# EAGLE design Light_Tester (EAGLE 6.3)
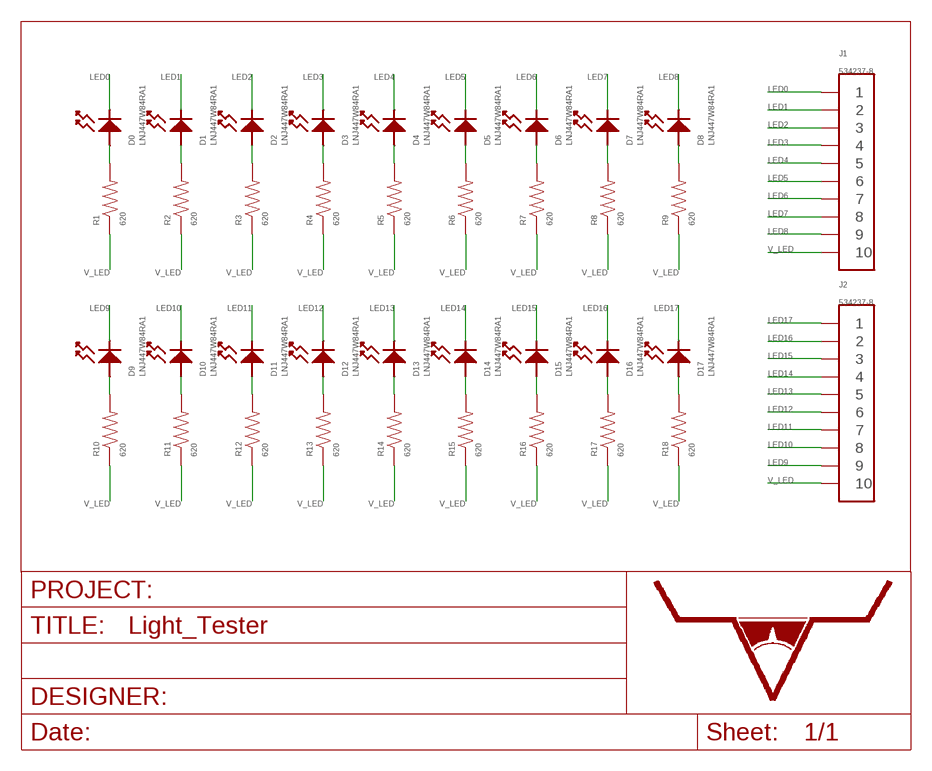
[diagram p0: schematic, sheet 1]

## Parts
D0  LNJ447W84RA1  LED_SINGLE0402  [LED_0402]
D1  LNJ447W84RA1  LED_SINGLE0402  [LED_0402]
D2  LNJ447W84RA1  LED_SINGLE0402  [LED_0402]
D3  LNJ447W84RA1  LED_SINGLE0402  [LED_0402]
D4  LNJ447W84RA1  LED_SINGLE0402  [LED_0402]
D5  LNJ447W84RA1  LED_SINGLE0402  [LED_0402]
D6  LNJ447W84RA1  LED_SINGLE0402  [LED_0402]
D7  LNJ447W84RA1  LED_SINGLE0402  [LED_0402]
D8  LNJ447W84RA1  LED_SINGLE0402  [LED_0402]
D9  LNJ447W84RA1  LED_SINGLE0402  [LED_0402]
D10  LNJ447W84RA1  LED_SINGLE0402  [LED_0402]
D11  LNJ447W84RA1  LED_SINGLE0402  [LED_0402]
D12  LNJ447W84RA1  LED_SINGLE0402  [LED_0402]
D13  LNJ447W84RA1  LED_SINGLE0402  [LED_0402]
D14  LNJ447W84RA1  LED_SINGLE0402  [LED_0402]
D15  LNJ447W84RA1  LED_SINGLE0402  [LED_0402]
D16  LNJ447W84RA1  LED_SINGLE0402  [LED_0402]
D17  LNJ447W84RA1  LED_SINGLE0402  [LED_0402]
J1  534237-8  PH_1X10PTH  [HEADER_01X10_PTH]
J2  534237-8  PH_1X10PTH  [HEADER_01X10_PTH]
R1  620  RESISTOR0402  [0402]
R2  620  RESISTOR0402  [0402]
R3  620  RESISTOR0402  [0402]
R4  620  RESISTOR0402  [0402]
R5  620  RESISTOR0402  [0402]
R6  620  RESISTOR0402  [0402]
R7  620  RESISTOR0402  [0402]
R8  620  RESISTOR0402  [0402]
R9  620  RESISTOR0402  [0402]
R10  620  RESISTOR0402  [0402]
R11  620  RESISTOR0402  [0402]
R12  620  RESISTOR0402  [0402]
R13  620  RESISTOR0402  [0402]
R14  620  RESISTOR0402  [0402]
R15  620  RESISTOR0402  [0402]
R16  620  RESISTOR0402  [0402]
R17  620  RESISTOR0402  [0402]
R18  620  RESISTOR0402  [0402]
U$1  LHE_FRAME  [LHE_FRAME]

## Nets
LED0: D0.CATHODE J1.1
LED1: D1.CATHODE J1.2
LED2: D2.CATHODE J1.3
LED3: D3.CATHODE J1.4
LED4: D4.CATHODE J1.5
LED5: D5.CATHODE J1.6
LED6: D6.CATHODE J1.7
LED7: D7.CATHODE J1.8
LED8: D8.CATHODE J1.9
LED9: D9.CATHODE J2.9
LED10: D10.CATHODE J2.8
LED11: D11.CATHODE J2.7
LED12: D12.CATHODE J2.6
LED13: D13.CATHODE J2.5
LED14: D14.CATHODE J2.4
LED15: D15.CATHODE J2.3
LED16: D16.CATHODE J2.2
LED17: D17.CATHODE J2.1
N$1: D1.ANODE R2.2
N$2: D0.ANODE R1.2
N$3: D2.ANODE R3.2
N$4: D3.ANODE R4.2
N$5: D4.ANODE R5.2
N$6: D5.ANODE R6.2
N$7: D6.ANODE R7.2
N$8: D7.ANODE R8.2
N$9: D8.ANODE R9.2
N$10: D9.ANODE R10.2
N$11: D10.ANODE R11.2
N$12: D11.ANODE R12.2
N$13: D12.ANODE R13.2
N$14: D13.ANODE R14.2
N$15: D14.ANODE R15.2
N$16: D15.ANODE R16.2
N$17: D16.ANODE R17.2
N$18: D17.ANODE R18.2
V_LED: J1.10 J2.10 R1.1 R2.1 R3.1 R4.1 R5.1 R6.1 R7.1 R8.1 R9.1 R10.1 R11.1 R12.1 R13.1 R14.1 R15.1 R16.1 R17.1 R18.1

## Library data of the parts
D0 D1-D17 = PP_LED:LED_SINGLE
J1 J2 = PP_Connectors:PH_1X10
R1-R18 = PP_Passives:RESISTOR: Resistors
U$1 = PP_Aesthetics:LHE_FRAME; DNAME: Parker Dillmann; PNAME: Light Tester For Tommy System; REVNUM: REV 0

## Board
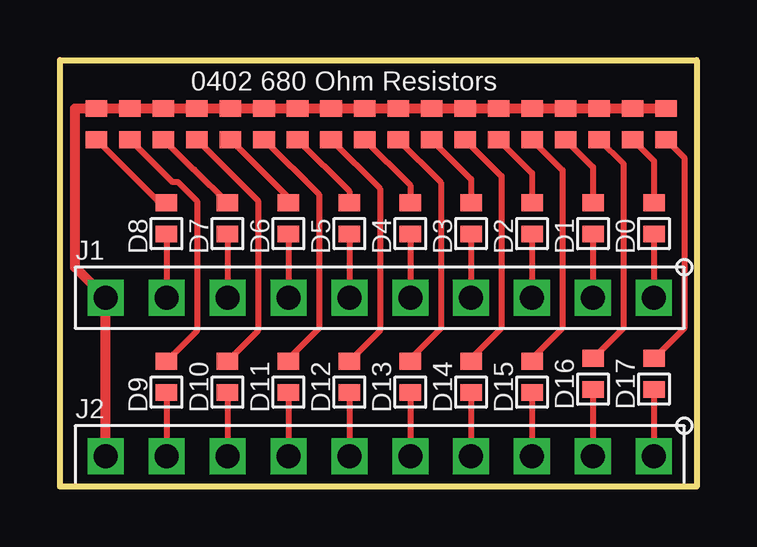
[diagram p1: board, top side]
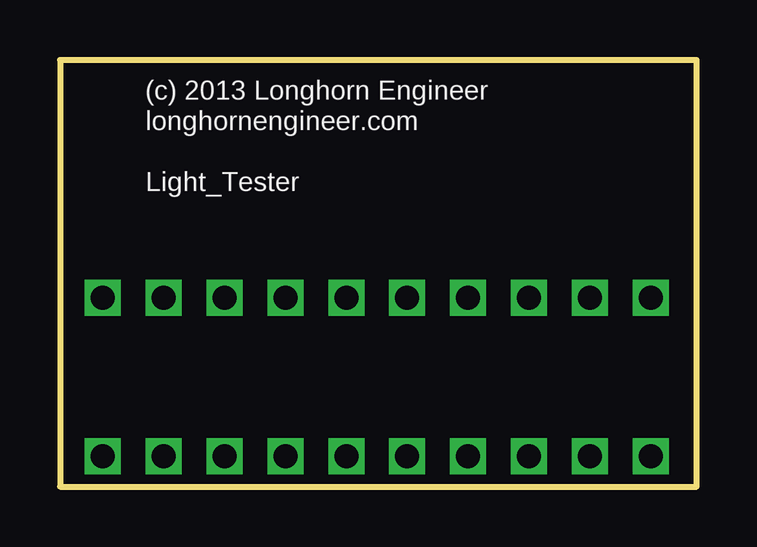
[diagram p2: board, bottom side, seen from below]

Size 26.54 x 17.78 mm. Coordinates in mm from the lower left corner, seen from the top.
Outline: 0,17.78 26.54,17.78 26.54,0 0,0 0,17.78
Copper layers (1*2*15*16): Top 0.035mm / dielectric 0.2mm / Route2 0.0175mm / dielectric 1.1mm / Route15 0.0175mm / dielectric 0.2mm / Bottom 0.035mm
Design rules "SeeedStudio_2_Layer_DRU": minimum track width 6mil, minimum drill 12mil, track to track 6mil, track to pad 6mil, pad to pad 6mil, via to via 6mil, smd to smd 0mil, copper to edge 10mil, drill to drill 10mil, minimum pad ring 6mil, minimum via ring 6mil, stop-mask expansion 2mil, vias tented up to drill 25mil, thermal gap 10mil

### Footprints (pad centres in the part's own frame; a part is rotated, then mirrored left to right if it is on the bottom)
LED_0402 = smd 0.7 x 0.9: ANODE 0.65,0; CATHODE -0.65,0
HEADER_01X10_PTH = drill 1 square: 1 -11.43,0; 2 -8.89,0; 3 -6.35,0; 4 -3.81,0; 5 -1.27,0; 6 1.27,0; 7 3.81,0; 8 6.35,0; 9 8.89,0; 10 11.43,0
0402 = smd 0.7 x 0.9: 1 -0.65,0; 2 0.65,0

### Placement (x,y rotation side)
D0  24.77,11.18 90 top
D1  22.23,11.18 90 top
D2  19.68,11.18 90 top
D3  17.14,11.18 90 top
D4  14.61,11.18 90 top
D5  12.06,11.18 90 top
D6  9.53,11.18 90 top
D7  6.98,11.18 90 top
D8  4.45,11.18 90 top
D9  4.45,4.57 90 top
D10  6.98,4.57 90 top
D11  9.53,4.57 90 top
D12  12.06,4.57 90 top
D13  14.61,4.57 90 top
D14  17.14,4.57 90 top
D15  19.68,4.57 90 top
D16  22.23,4.7 90 top
D17  24.77,4.7 90 top
J1  13.34,7.87 180 top
J2  13.34,1.27 180 top
R1  23.88,15.11 270 top
R2  21.08,15.11 270 top
R3  18.29,15.11 270 top
R4  15.49,15.11 270 top
R5  12.7,15.11 270 top
R6  9.91,15.11 270 top
R7  7.11,15.11 270 top
R8  4.32,15.11 270 top
R9  1.52,15.11 270 top
R10  2.92,15.11 270 top
R11  5.71,15.11 270 top
R12  8.51,15.11 270 top
R13  11.3,15.11 270 top
R14  14.1,15.11 270 top
R15  16.89,15.11 270 top
R16  19.68,15.11 270 top
R17  22.48,15.11 270 top
R18  25.27,15.11 270 top
U$1  22.99,11.05 0 bottom

### Tracks (layer width: path | path; a pad name or v marks a point on that pad's centre or on a via)
LED0
  Top 0.254: D0.CATHODE J1.1
LED1
  Top 0.254: D1.CATHODE J1.2
LED2
  Top 0.254: D2.CATHODE J1.3
LED3
  Top 0.254: D3.CATHODE J1.4
LED4
  Top 0.254: D4.CATHODE J1.5
LED5
  Top 0.254: D5.CATHODE J1.6
LED6
  Top 0.254: D6.CATHODE J1.7
LED7
  Top 0.254: D7.CATHODE J1.8
LED8
  Top 0.254: D8.CATHODE J1.9
LED9
  Top 0.254: D9.CATHODE J2.9
LED10
  Top 0.254: D10.CATHODE J2.8
LED11
  Top 0.254: D11.CATHODE J2.7
LED12
  Top 0.254: D12.CATHODE J2.6
LED13
  Top 0.254: D13.CATHODE J2.5
LED14
  Top 0.254: D14.CATHODE J2.4
LED15
  Top 0.254: D15.CATHODE J2.3
LED16
  Top 0.254: D16.CATHODE J2.2
LED17
  Top 0.254: D17.CATHODE J2.1
N$1
  Top 0.254: R2.2 22.23,13.32 D1.ANODE
N$2
  Top 0.254: R1.2 24.77,13.57 D0.ANODE
N$3
  Top 0.254: R3.2 19.68,13.07 D2.ANODE
N$4
  Top 0.254: R4.2 17.14,12.81 D3.ANODE
N$5
  Top 0.254: R5.2 14.61,12.56 D4.ANODE
N$6
  Top 0.254: R6.2 12.06,12.3 D5.ANODE
N$7
  Top 0.254: R7.2 9.53,12.05 D6.ANODE
N$8
  Top 0.254: D7.ANODE 5.6,13.21 5.57,13.21 R8.2
N$9
  Top 0.254: R9.2 4.16,11.83 D8.ANODE
N$10
  Top 0.254: R10.2 4.68,12.7 4.91,12.7 5.71,11.9 5.71,6.49 D9.ANODE
N$11
  Top 0.254: D10.ANODE 8.26,6.49 8.26,11.92 R11.2
N$12
  Top 0.254: R12.2 10.79,12.18 10.79,6.6 9.53,5.33 D11.ANODE
N$13
  Top 0.254: R13.2 13.34,12.43 13.34,6.49 D12.ANODE
N$14
  Top 0.254: R14.2 15.88,12.69 15.88,6.6 14.61,5.33 D13.ANODE
N$15
  Top 0.254: R15.2 18.41,12.94 18.41,6.6 17.14,5.33 D14.ANODE
N$16
  Top 0.254: R16.2 20.96,13.19 20.96,6.6 19.68,5.33 D15.ANODE
N$17
  Top 0.254: R17.2 23.5,13.45 23.5,6.6 D16.ANODE
N$18
  Top 0.254: R18.2 26.04,13.7 26.04,6.6 24.78,5.35 D17.ANODE
V_LED
  Top 0.406: J2.10 J1.10 0.64,9.14 0.64,15.76 R9.1 R10.1 R8.1 R11.1 R7.1 R12.1 R6.1 R13.1 R5.1 R14.1 R4.1 R15.1 R3.1 R16.1 R2.1 R17.1 R1.1 R18.1

### Text on the board
tPlace: 0402 680 Ohm Resistors